# Altium schematic sheet ESP32.SchDoc: =ProjectName
size A4; CheckedBy: DatNB; Author: Ven; CompanyName: Nacentech; Organization: IMET
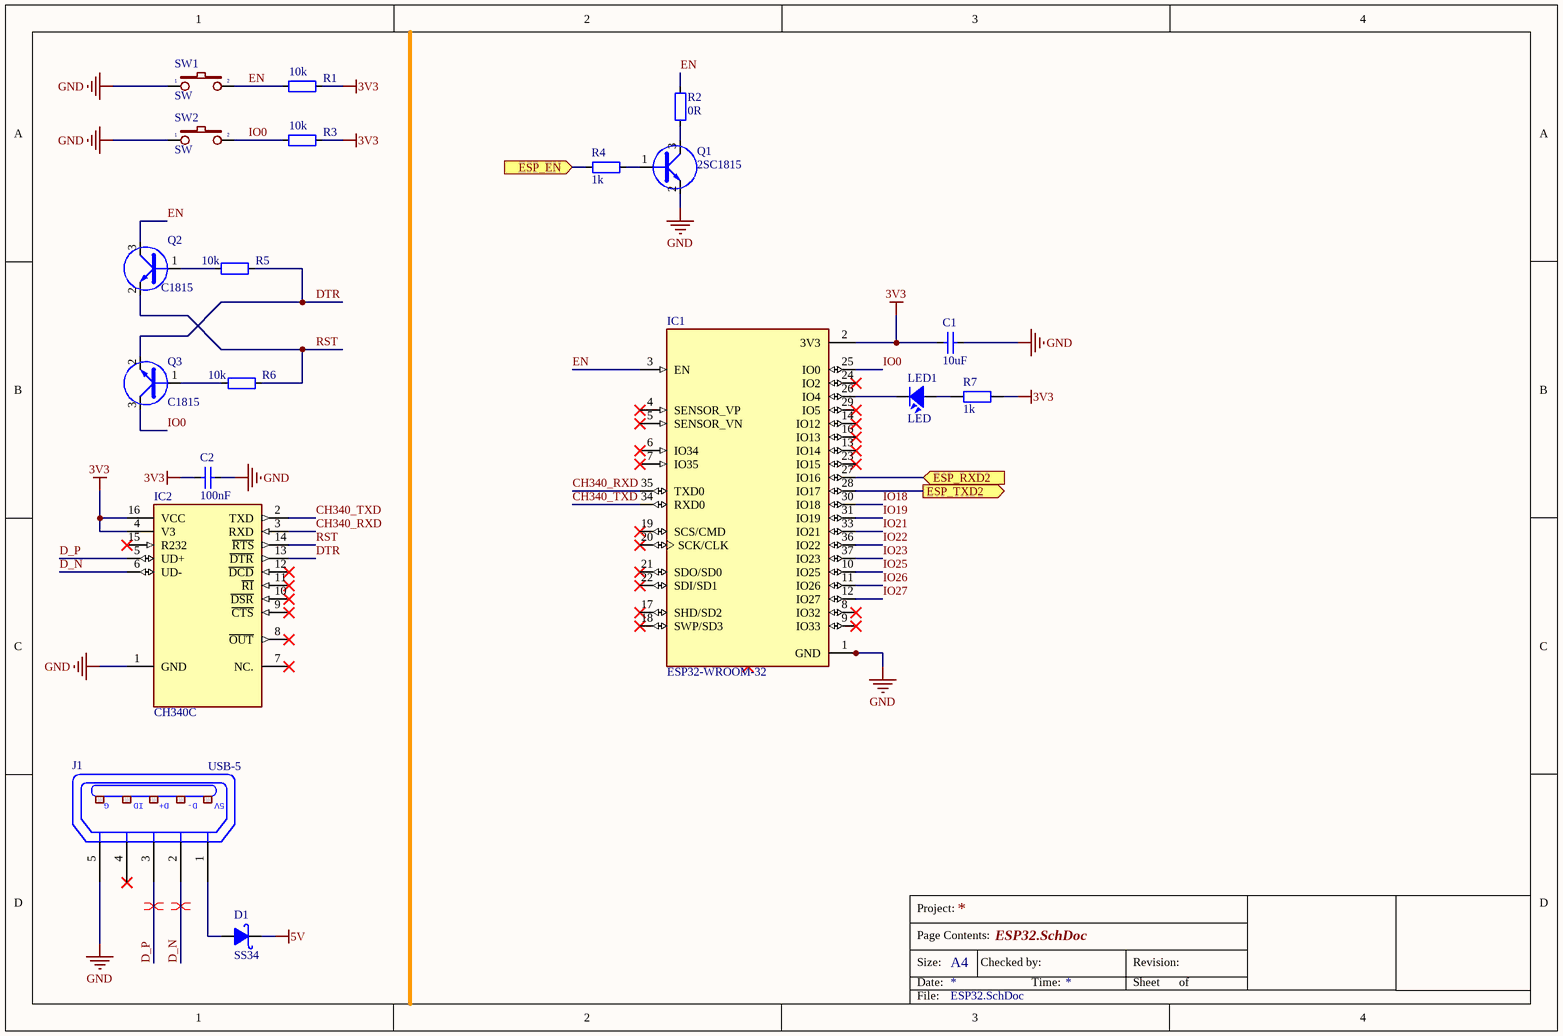
[diagram p0: ESP32.SchDoc]

## Parts
C1  10uF  [CAP_0805]
C2  100nF  [CAP_0805]
D1  SS34  [DO-214AC(SMA)]
IC1  ESP32-WROOM-32  [MODULE_ESP32-WROOM-32]
IC2  CH340C  [SO16]
J1  USB-5  [USB-M4]
LED1  LED  [LED-0805-Blue]
Q1  2SC1815  [SOT23D]
Q2  C1815  [SOT23D]
Q3  C1815  [SOT23D]
R1  10k  [RES-SMD-0805]
R2  0R  [RES-SMD-0805]
R3  10k  [RES-SMD-0805]
R4  1k  [RES-SMD-0805]
R5  10k  [RES-SMD-0805]
R6  10k  [RES-SMD-0805]
R7  1k  [RES-SMD-0805]
SW1  SW  [SW 3x2x4]
SW2  SW  [SW 3x2x4]

## Ports
ESP_EN (in), ESP_RXD2 (in), ESP_TXD2 (out)

## Nets
3V3: C1.1 C2.1 IC1.2(3V3) IC2.4(V3) IC2.16(VCC) R1.1 R3.1 R7.1
5V: D1.2(K)
GND: C1.2 C2.2 IC1.1(GND) IC1.15(GND) IC1.38(GND) IC1.39_1(GND) IC1.39_2(GND) IC1.39_3(GND) IC1.39_4(GND) IC1.39_5(GND) IC1.39_6(GND) IC1.39_7(GND) IC1.39_8(GND) IC1.39_9(GND) IC1.39_10(GND) IC1.39_11(GND) IC1.39_12(GND) IC1.39_13(GND) IC1.39_14(GND) IC1.39_15(GND) IC1.39_16(GND) IC1.39_17(GND) IC1.39_18(GND) IC1.39_19(GND) IC1.39_20(GND) IC1.39_21(GND) IC2.1(GND) J1.5(P5) Q1.2(E) SW1.1 SW2.1
CH340_RXD: IC1.35(TXD0) IC2.3(RXD)
CH340_TXD: IC1.34(RXD0) IC2.2(TXD)
D_N: IC2.6(UD-) J1.2(P2)
D_P: IC2.5(UD+) J1.3(P3)
DTR: IC2.13(~{DTR}) Q3.2(E) R5.1
EN: IC1.3(EN) Q2.3(C) R1.2 R2.2 SW1.2
ESP_EN: R4.2 ; port ESP_EN
ESP_RXD2: IC1.27(IO16) ; port ESP_RXD2
ESP_TXD2: IC1.28(IO17) ; port ESP_TXD2
IO0: IC1.25(IO0) Q3.3(C) R3.2 SW2.2
IO18: IC1.30(IO18)
IO19: IC1.31(IO19)
IO21: IC1.33(IO21)
IO22: IC1.36(IO22)
IO23: IC1.37(IO23)
IO25: IC1.10(IO25)
IO26: IC1.11(IO26)
IO27: IC1.12(IO27)
RST: IC2.14(~{RTS}) Q2.2(E) R6.1
NetD1_1: D1.1(A) J1.1(P1)
NetIC1_26: IC1.26(IO4) LED1.2
NetLED1_1: LED1.1 R7.2
NetQ1_1: Q1.1(B) R4.1
NetQ1_3: Q1.3(C) R2.1
NetQ2_1: Q2.1(B) R5.2
NetQ3_1: Q3.1(B) R6.2

Not connected (* = marked no-connect by the designer): IC1 4(SENSOR_VP)* 5(SENSOR_VN)* 6(IO34)* 7(IO35)* 8(IO32)* 9(IO33)* 13(IO14)* 14(IO12)* 16(IO13)* 17(SHD/SD2)* 18(SWP/SD3)* 19(SCS/CMD)* 20(SCK/CLK)* 21(SDO/SD0)* 22(SDI/SD1)* 23(IO15)* 24(IO2)* 29(IO5)*; IC2 7(NC.)* 8(~{OUT})* 9(~{CTS})* 10(~{DSR})* 11(~{RI})* 12(~{DCD})* 15(R232)*; J1 4(P4)*

## Layout directives
differential pair: D_N, D_P

## Notes on the sheet
- Project:
- Page Contents:
- Size:
- Date:
- A4
- Checked by:
- Time:
- Revision:
- Sheet
- of
- File:
- (in symbol USB-5) G; ID; D+; D-; 5V

## Library data of the parts
C1 C2 = CapSMD: Capacitor; Value: 33p; Published: 8-Jun-2000; LatestRevisionDate: 17-Jul-2002; LatestRevisionNote: Re-released for DXP Platform.; PackageReference: RAD-0.3; Publisher: Altium Limited
D1 = Diode Schottky: Diode Schottky SS34
IC1 = ESP32-WROOM-32: Bluetooth, WiFi Transceiver Module 2.4GHz ~ 2.5GHz Surface Mount; MF: Espressif Systems; Package: Module Espressif Systems; Digi-Key_Part_Number: 1904-1010-1-ND; Digi-Key_Purchase_URL: https://www.digikey.com/product-detail/en/espressif-systems/ESP32-WROOM-32/1904-1010-1-ND/8544305?utm_source=snapeda&utm_medium=aggregator&utm_campaign=symbol; Value: *; MP: ESP32-WROOM-32; SnapEDA_Link: https://www.snapeda.com/parts/ESP32-WROOM-32/Espressif%20Systems/view-part/2753322/?ref=snap
J1 = USB-5: Manufacturer: FCI; Manufacturer Part Number: 10118193-0001LF; Connector Type: USB - micro B; Number of Contacts: 5; Gender: Receptacle; Specifications: USB 2.0; .Creator: MM; .Checked PCB: RF; Supplier 1: Digi-Key; RoHS: RoHS Compliant; Category: Connectors, Interconnects; Stock 1: 28642; Pricing 1: 1=0.46, 10=0.433, 25=0.3712, 50=0.3156, 100=0.3032, 250=0.27224, 500=0.25988 (USD); Packaging: Cut Tape (CT); Mounting Type: Surface Mount, Right Angle, Horizontal; Features: Shielded, Solder Retention; Ingress Protection: -; ComponentLink1URL: http://portal.fciconnect.com/Comergent//fci/drawing/10118193.pdf; ComponentLink1Description: http://portal.fciconnect.com/Comergent//fci/drawing/10118193.pdf; Supplier Part Number 1: 609-4616-1-ND; .Checked SCH: MM
LED1 = LED: LED Single colour Green and Red; Value: LED 3 ly Single Colour
Q1 = C1815: NPN 600mW, ECB; Value: C1815
Q2 Q3 = 2SC1815: NPN 600mW, ECB; Value: C1815
R1-R6 = Resistor - SMD: Resistor; Manufacturer: Generic Components; Class: Passive; Published: 08/06/2000; Publisher: Altium Hobart Technology Centre
R7 = Resistor - SMD: Resistor SMD; Manufacturer: Generic Components; Class: Passive; Published: 08/06/2000; Publisher: Altium Hobart Technology Centre
SW1 SW2 = SW2: Switch button 2 pin; Value: SW chip 2 pin